# EAGLE design C2_from_parallel_port (EAGLE 6.3)
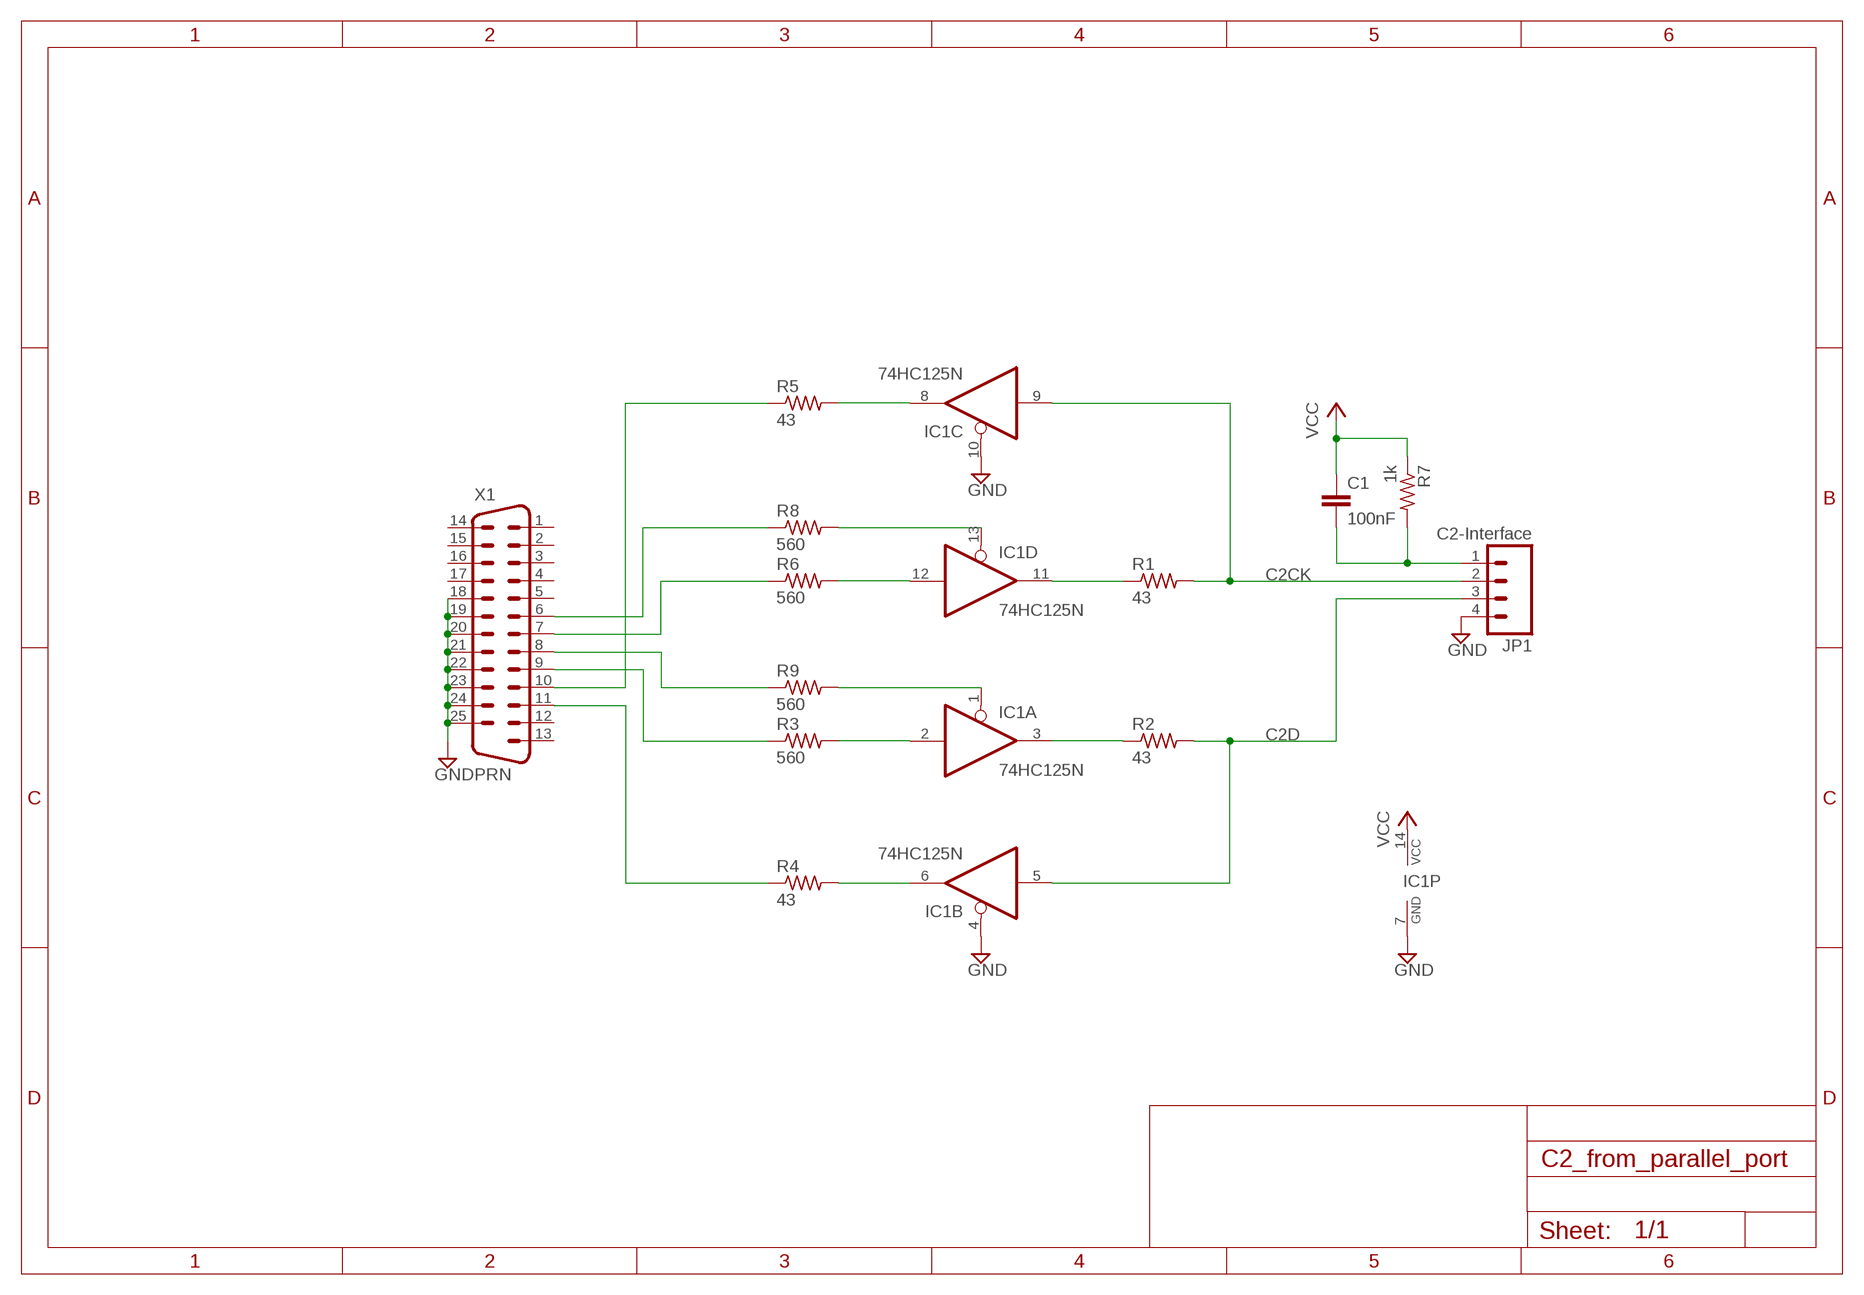
[diagram p0: schematic, sheet 1]

## Parts
C1  100nF  RCL_C-EU050-025X075  [RCL_C050-025X075]
IC1  74HC125N  [DIL14]
JP1  C2-Interface  M04POLAR  [MOLEX-1X4]
R1  43  RCL_R-US_0204/2V  [RCL_0204V]
R2  43  RCL_R-US_0204/2V  [RCL_0204V]
R3  560  RCL_R-US_0204/2V  [RCL_0204V]
R4  43  RCL_R-US_0204/2V  [RCL_0204V]
R5  43  RCL_R-US_0204/2V  [RCL_0204V]
R6  560  RCL_R-US_0204/2V  [RCL_0204V]
R7  1k  RCL_R-US_0204/2V  [RCL_0204V]
R8  560  RCL_R-US_0204/2V  [RCL_0204V]
R9  560  RCL_R-US_0204/2V  [RCL_0204V]
X1  PRN  DB25D  [M25D]

## Nets
C2CK: IC1.9(C:I) JP1.2 R1.2
C2D: IC1.5(B:I) JP1.3 R2.2
GND: IC1.4(B:OE) IC1.7(P:GND) IC1.10(C:OE) JP1.4 X1.18 X1.19 X1.20 X1.21 X1.22 X1.23 X1.24 X1.25
N$1: IC1.8(C:O) R5.2
N$2: IC1.13(D:OE) R8.2
N$3: IC1.12(D:I) R6.2
N$4: IC1.1(A:OE) R9.2
N$5: IC1.2(A:I) R3.2
N$6: IC1.6(B:O) R4.2
N$7: R8.1 X1.6
N$8: R6.1 X1.7
N$9: R9.1 X1.8
N$10: R3.1 X1.9
N$11: R4.1 X1.11
N$12: R5.1 X1.10
N$13: IC1.11(D:O) R1.1
N$14: IC1.3(A:O) R2.1
N$15: C1.2 JP1.1 R7.2
VCC: C1.1 IC1.14(P:VCC) R7.1
Unconnected: X1.1 X1.2 X1.3 X1.4 X1.5 X1.12 X1.13 X1.14 X1.15 X1.16 X1.17

## Library data of the parts
C1 = ipas:RCL_C-EU: CAPACITOR, European symbol
IC1 = 74xx-eu:74*125: Quad bus BUFFER, 3-state
JP1 = ipas:M04: Header 4 Standard 4-pin 0.1" header. Use with straight break away headers (SKU : PRT-00116), right angle break away headers (PRT-00553), swiss pins (PRT-00743), machine pins (PRT-00117), and female headers (PRT-00115). Molex polarized connector foot print use with SKU : PRT-08231 with associated crimp pins and housings. 1MM SMD Version SKU: PRT-10208
R1-R9 = ipas:RCL_R-US_: RESISTOR, American symbol
X1 = SparkFun-Connectors:DB25: Various DB25 connectors

## Board
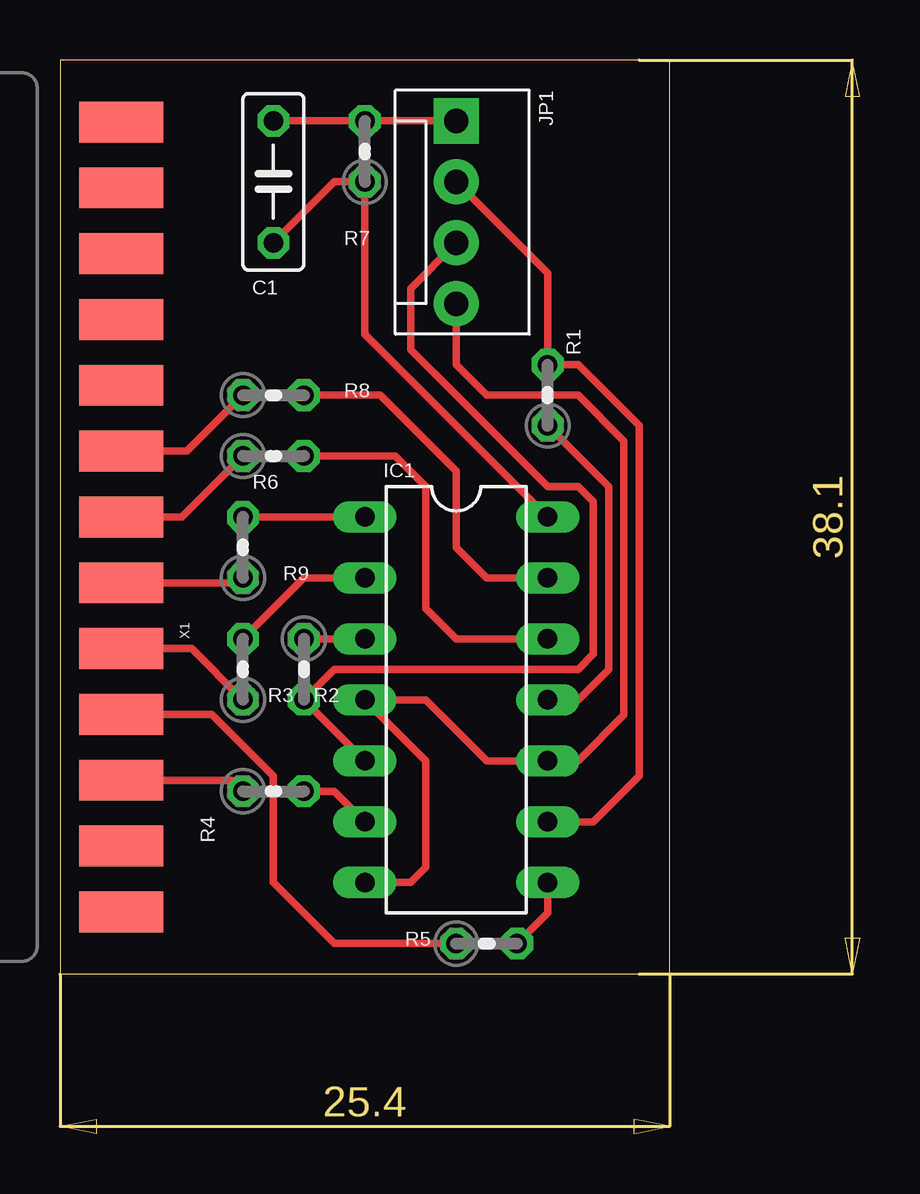
[diagram p1: board, top side]
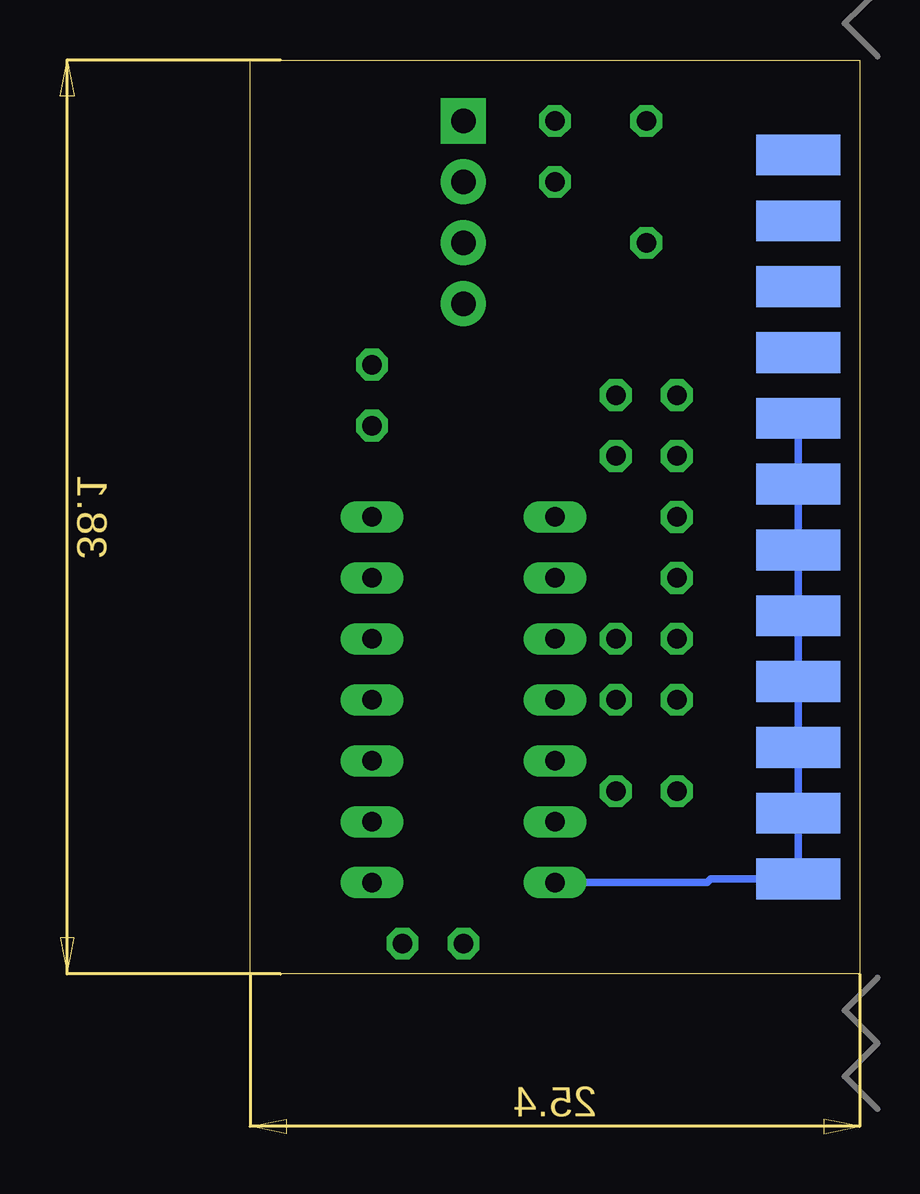
[diagram p2: board, bottom side, seen from below]

Size 25.4 x 38.1 mm. Coordinates in mm from the lower left corner, seen from the top.
Outline: 0,0 25.4,0 25.4,38.1 0,38.1 0,0
Copper layers (1*16): Top 0.035mm / dielectric 1.5mm / Bottom 0.035mm
Design rules "default *": minimum track width 12mil, minimum drill 24mil, track to track 12mil, track to pad 12mil, pad to pad 12mil, via to via 12mil, smd to smd 12mil, copper to edge 40mil, drill to drill 12mil, minimum pad ring 10mil, minimum via ring 8mil, stop-mask expansion 4mil, vias tented up to drill 0mil, thermal gap 10mil

### Footprints (pad centres in the part's own frame; a part is rotated, then mirrored left to right if it is on the bottom)
RCL_C050-025X075 = drill 0.813 octagon: 1 -2.54,0; 2 2.54,0
DIL14 = drill 0.813 long: 1 -7.62,-3.81; 2 -5.08,-3.81; 3 -2.54,-3.81; 4 0,-3.81; 5 2.54,-3.81; 6 5.08,-3.81; 7 7.62,-3.81; 8 7.62,3.81; 9 5.08,3.81; 10 2.54,3.81; 11 0,3.81; 12 -2.54,3.81; 13 -5.08,3.81; 14 -7.62,3.81
MOLEX-1X4 = drill 1.016 pad 1.88 square: 1 0,0 | drill 1.016 pad 1.88: 2 2.54,0; 3 5.08,0; 4 7.62,0
RCL_0204V = drill 0.813 octagon: 1 -1.27,0; 2 1.27,0
M25D = smd 1.7 x 3.5: 1 16.459,-6.045; 2 13.716,-6.045; 3 10.973,-6.045; 4 8.23,-6.045; 5 5.486,-6.045; 6 2.743,-6.045; 7 0,-6.045; 8 -2.743,-6.045; 9 -5.486,-6.045; 10 -8.23,-6.045; 11 -10.973,-6.045; 12 -13.716,-6.045; 13 -16.459,-6.045 | smd 1.7 x 3.5 bottom: 14 15.088,-6.045; 15 12.344,-6.045; 16 9.601,-6.045; 17 6.858,-6.045; 18 4.115,-6.045; 19 1.372,-6.045; 20 -1.372,-6.045; 21 -4.115,-6.045; 22 -6.858,-6.045; 23 -9.601,-6.045; 24 -12.344,-6.045; 25 -15.088,-6.045

### Placement (x,y rotation side)
C1  8.89,33.02 90 top
IC1  16.51,11.43 270 top
JP1  16.51,35.56 270 top
R1  20.32,24.13 90 top
R2  10.16,12.7 270 top
R3  7.62,12.7 90 top
R4  8.89,7.62 0 top
R5  17.78,1.27 0 top
R6  8.89,21.59 0 top
R7  12.7,34.29 90 top
R8  8.89,24.13 0 top
R9  7.62,17.78 90 top
X1  -3.49,19.05 90 top

### Tracks (layer width: path | path; a pad name or v marks a point on that pad's centre or on a via)
C2CK
  Top 0.305: JP1.2 20.32,29.21 R1.2 21.59,25.4 24.13,22.86 24.13,8.26 22.23,6.35 IC1.9
C2D
  Top 0.305: IC1.5 R2.2 11.43,12.7 21.59,12.7 22.23,13.33 22.23,19.68 21.59,20.32 20.32,20.32 14.61,26.04 14.61,28.57 JP1.3
GND
  Top 0.305: IC1.7 14.61,3.81 15.24,4.45 15.24,8.89 IC1.4 15.24,11.43 17.78,8.89 IC1.10 21.59,8.89 23.5,10.79 23.5,22.22 21.59,24.13 17.78,24.13 16.51,25.4 JP1.4
  Bottom 0.305: X1.18 X1.19 X1.20 X1.21 X1.22 X1.23 X1.24 X1.25 6.2,3.96 6.35,3.81 IC1.7
N$1
  Top 0.305: R5.2 20.32,2.54 IC1.8
N$2
  Top 0.305: IC1.13 17.78,16.51 16.51,17.78 16.51,20.95 13.34,24.13 R8.2
N$3
  Top 0.305: IC1.12 16.51,13.97 15.24,15.24 15.24,20.32 13.97,21.59 R6.2
N$4
  Top 0.305: R9.2 IC1.1
N$5
  Top 0.305: R3.2 10.16,16.51 IC1.2
N$6
  Top 0.305: R4.2 11.43,7.62 IC1.6
N$7
  Top 0.305: R8.1 5.28,21.79 X1.6
N$8
  Top 0.305: X1.7 5.08,19.05 R6.1
N$9
  Top 0.305: X1.8 7.42,16.31 R9.1
N$10
  Top 0.305: X1.9 5.49,13.56 R3.1
N$11
  Top 0.305: X1.11 7.16,8.08 R4.1
N$12
  Top 0.305: X1.10 6.33,10.82 8.89,8.26 8.89,3.81 11.43,1.27 R5.1
N$13
  Top 0.305: IC1.11 21.59,11.43 22.86,12.7 22.86,20.32 R1.1
N$14
  Top 0.305: IC1.3 R2.1
N$15
  Top 0.305: C1.2 R7.2 JP1.1
VCC
  Top 0.305: C1.1 11.43,33.02 R7.1 12.7,26.67 IC1.14